# Altium schematic sheet MCU_STM32F103C8T6.SchDoc
size 381 x 241 mm; SheetNumber: 2; SheetTotal: 6
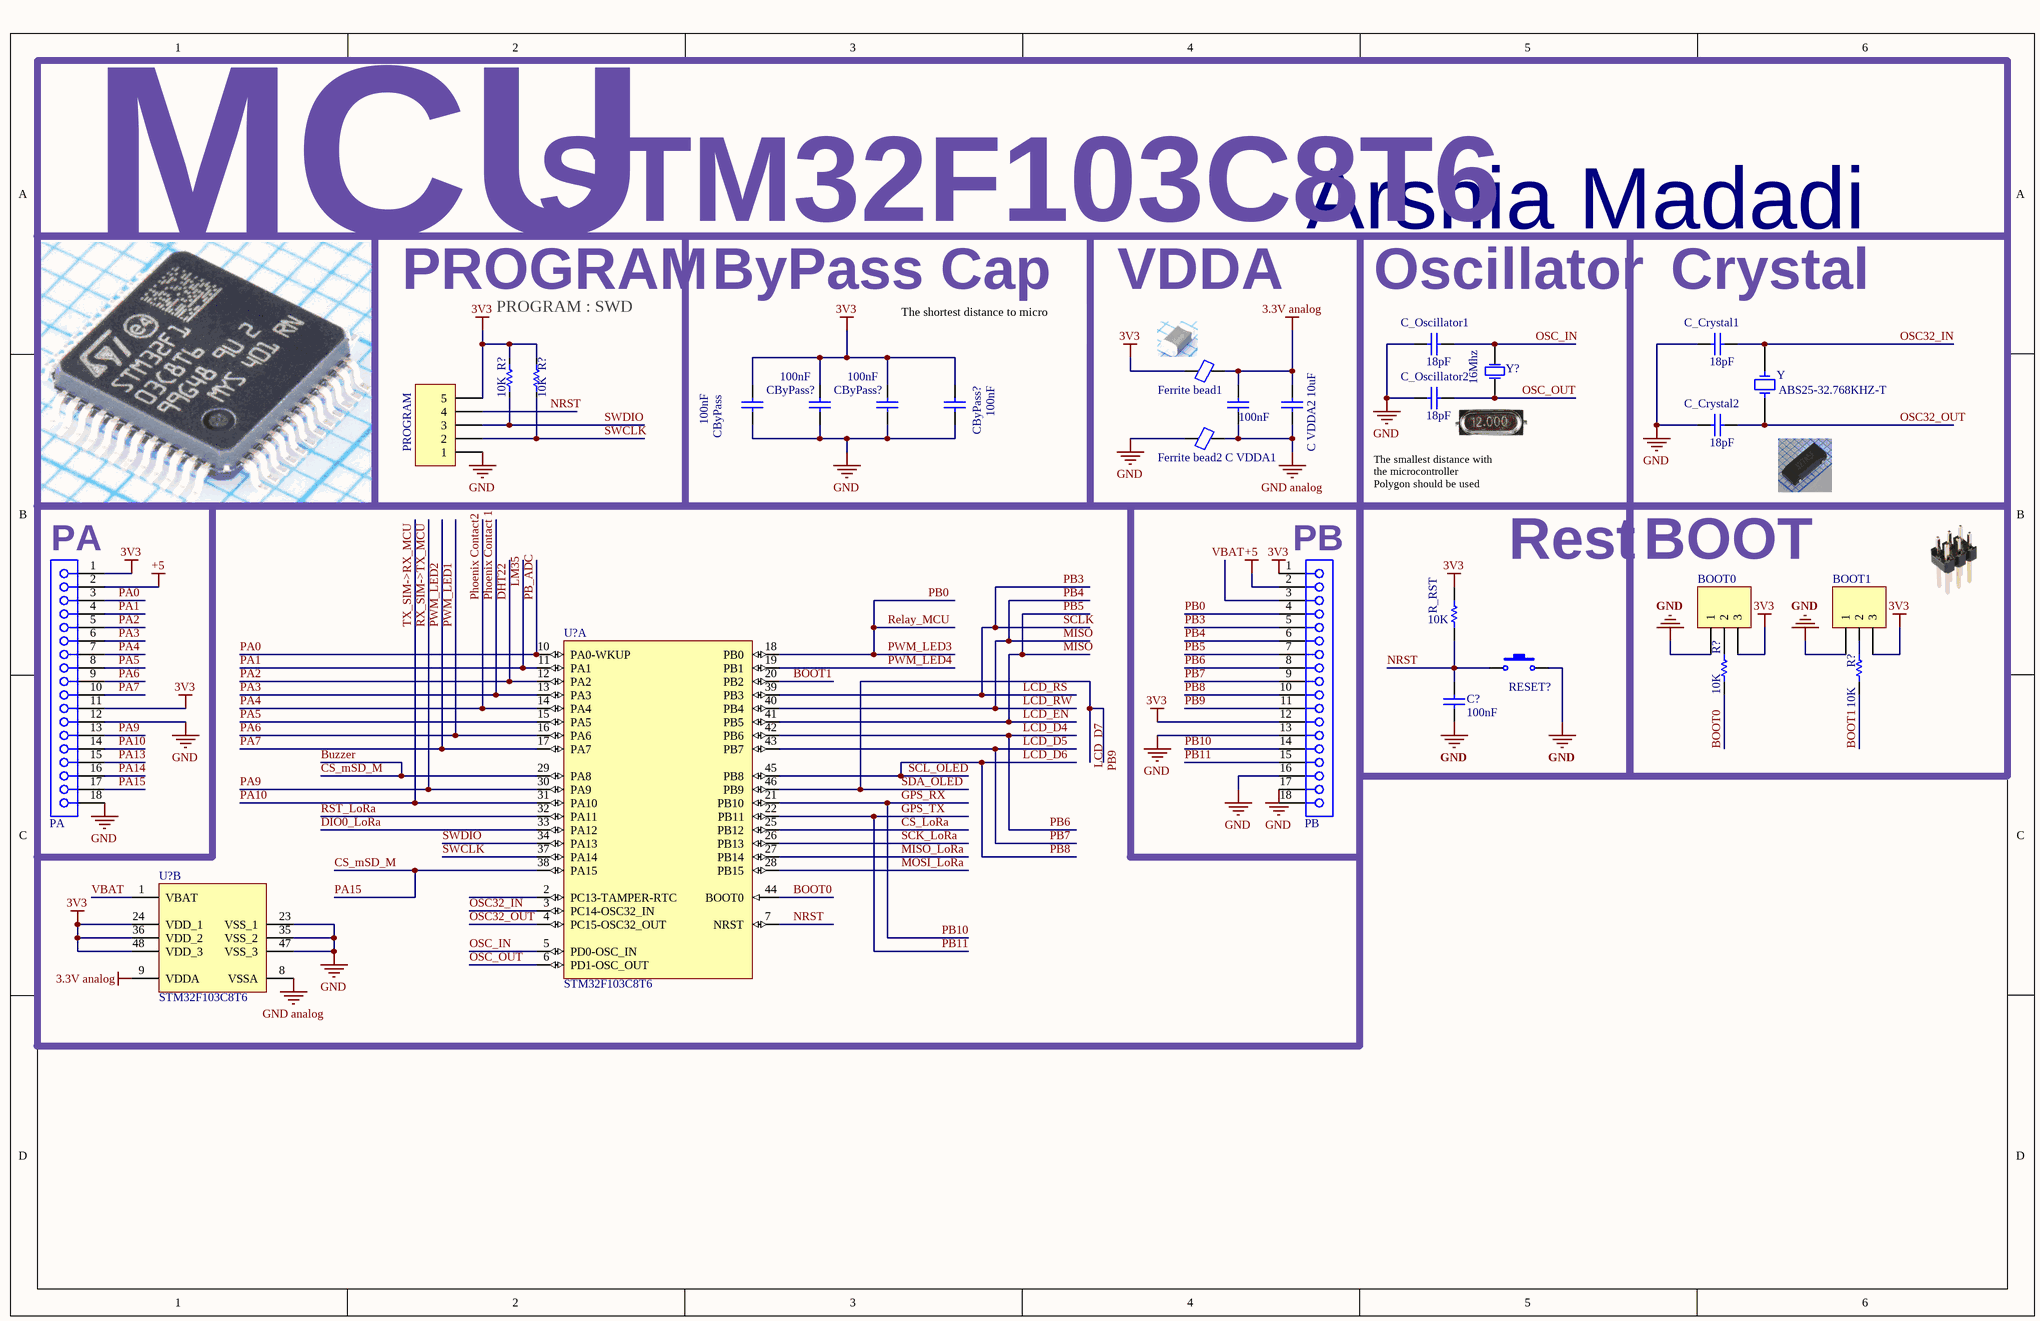
[diagram p0: MCU_STM32F103C8T6.SchDoc]

## Parts
(Parts that share a designator on the sheet are numbered #1, #2 ... from top to bottom, then left to right.)
BOOT0  Header 3  [My_1X03]  (value not drawn)
BOOT1  Header 3  [My_1X03]  (value not drawn)
C?  100nF  [CAPC4817X12N]
C_Crystal1  18pF  [CAPC4817X12N]
C_Crystal2  18pF  [CAPC4817X12N]
C_Oscillator1  18pF  [CAPC4817X12N]
C_Oscillator2  18pF  [CAPC4817X12N]
C_VDDA1  100nF  [CAPC4817X12N]
C_VDDA2  10uF  [CAPC4817X12N]
CByPass  100nF  [CAPC4817X12N]
CByPass?#1  100nF  [CAPC4817X12N]
CByPass?#2  100nF  [CAPC4817X12N]
CByPass?#3  100nF  [CAPC4817X12N]
Ferrite_bead1  Ferrite Bead SMD  [FB1206]  (value not drawn)
Ferrite_bead2  Ferrite Bead SMD  [FB1206]  (value not drawn)
PA  61301811821  [61301811821]  (value not drawn)
PB  61301811821  [61301811821]  (value not drawn)
PROGRAM  Header 5  [My_1X05]  (value not drawn)
R?#1  10K  [1206_Res]
R?#2  10K  [1206_Res]
R?#3  10K  [RESC4817X04N]
R?#4  10K  [RESC4817X04N]
R_RST  10K  [RESC4817X04N]
RESET?  Switch PB  [Switch - Push to On]  (value not drawn)
U?#1  STM32F103C8T6  [STM-LQFP48_M]  (part A of 2)
U?#2  STM32F103C8T6  [STM-LQFP48_M]  (part B of 2)
Y  ABS25-32.768KHZ-T  [XTAL_ABS25-32.768KHZ-6-1-T]
Y?  16Mhz  [Crystal]

## Blocks framed on the sheet
MCU: C_Crystal1 C_Crystal2 C_Oscillator1 C_Oscillator2 C_VDDA1 C_VDDA2 CByPass CByPass?#1-CByPass?#3 Ferrite_bead1 Ferrite_bead2 PROGRAM R?#1 R?#2 Y Y?
PA: PA
PB: PB
Rest: C? R_RST RESET?
BOOT: BOOT0 BOOT1 R?#3 R?#4

## Nets
3.3V analog: C_VDDA1.2 C_VDDA2.2 Ferrite_bead1.2 U?#2.9(VDDA)
3V3: BOOT0.3 BOOT1.3 CByPass.2 CByPass?#1.2 CByPass?#2.2 CByPass?#3.2 Ferrite_bead1.1 PA.1 PA.11 PB.1 PB.12 PROGRAM.5 R?#1.2 R?#2.2 R_RST.2 U?#2.24(VDD_1) U?#2.36(VDD_2) U?#2.48(VDD_3)
+5: PA.2 PB.2
GND: BOOT0.1 BOOT1.1 C?.1 C_Crystal1.1 C_Crystal2.1 C_Oscillator1.1 C_Oscillator2.1 CByPass.1 CByPass?#1.1 CByPass?#2.1 CByPass?#3.1 Ferrite_bead2.1 PA.12 PA.18 PB.13 PB.16 PB.17 PROGRAM.1 RESET?.2 U?#2.23(VSS_1) U?#2.35(VSS_2) U?#2.47(VSS_3)
GND analog: C_VDDA1.1 C_VDDA2.1 Ferrite_bead2.2 U?#2.8(VSSA)
BOOT0: R?#3.1 U?#1.44(BOOT0)
BOOT1: R?#4.1 U?#1.20(PB2)
Buzzer: PA.17 U?#1.29(PA8) U?#1.38(PA15)  [also labelled CS_mSD_M, PA15]
CS_LoRa: U?#1.25(PB12)
DHT22: PA.5 U?#1.12(PA2)  [also labelled PA2]
DIO0_LoRa: U?#1.33(PA12)
GPS_RX: PB.14 U?#1.21(PB10)  [also labelled PB10]
GPS_TX: PB.15 U?#1.22(PB11)  [also labelled PB11]
LCD_D4: PB.8 U?#1.42(PB6)  [also labelled PB6]
LCD_D5: PB.9 U?#1.43(PB7)  [also labelled PB7]
LCD_D6: PB.10 U?#1.45(PB8)  [also labelled PB8, SCL_OLED]
LCD_D7: PB.11 U?#1.46(PB9)  [also labelled PB9, SDA_OLED]
LCD_EN: PB.6 PB.7 U?#1.40(PB4) U?#1.41(PB5)  [also labelled LCD_RW, MISO, PB4, PB5]
LCD_RS: PB.5 U?#1.39(PB3)  [also labelled PB3, SCLK]
LM35: PA.4 U?#1.11(PA1)  [also labelled PA1]
MISO_LoRa: U?#1.27(PB14)
MOSI_LoRa: U?#1.28(PB15)
NRST: C?.2 PROGRAM.4 R_RST.1 RESET?.1 U?#1.7(NRST)
OSC32_IN: C_Crystal1.2 U?#1.3(PC14-OSC32_IN) Y.4
OSC32_OUT: C_Crystal2.2 U?#1.4(PC15-OSC32_OUT) Y.1
OSC_IN: C_Oscillator1.2 U?#1.5(PD0-OSC_IN) Y?.2(OSC2)
OSC_OUT: C_Oscillator2.2 U?#1.6(PD1-OSC_OUT) Y?.1(OSC1)
PA0: PA.3 U?#1.10(PA0-WKUP)  [also labelled PB_ADC]
PA3: PA.6 U?#1.13(PA3)  [also labelled Phoenix Contact 1]
PA4: PA.7 U?#1.14(PA4)  [also labelled Phoenix Contact2]
PA5: PA.8 U?#1.15(PA5)
PA6: PA.9 U?#1.16(PA6)  [also labelled PWM_LED1]
PA7: PA.10 U?#1.17(PA7)  [also labelled PWM_LED2]
PA9: PA.13 U?#1.30(PA9)  [also labelled RX_SIM->TX_MCU]
PA10: PA.14 U?#1.31(PA10)  [also labelled TX_SIM->RX_MCU]
PA13: PA.15
PA14: PA.16
PB0: PB.4 U?#1.18(PB0)  [also labelled PWM_LED3, Relay_MCU]
PWM_LED4: U?#1.19(PB1)
RST_LoRa: U?#1.32(PA11)
SCK_LoRa: U?#1.26(PB13)
SWCLK: PROGRAM.2 R?#2.1 U?#1.37(PA14)
SWDIO: PROGRAM.3 R?#1.1 U?#1.34(PA13)
VBAT: U?#2.1(VBAT)
NetBOOT1_2: BOOT1.2 R?#4.2

Not connected (* = marked no-connect by the designer): BOOT0 2; PB 3 18; R?#3 2; U?#1 2(PC13-TAMPER-RTC)

## Notes on the sheet
- STM32F103C8T6
- Arshia Madadi
- PROGRAM
- (near R?#1) PROGRAM : SWD
- ByPass Cap
- VDDA
- Oscillator
- (near C_Crystal1) Crystal
- The shortest distance to micro
- The smallest distance with the microcontroller
  Polygon should be used
- Labels drawn without touching a wire or pin: VBAT

## Library data of the parts
BOOT0 BOOT1 = Header 3: Header, 3-Pin; LatestRevisionDate: 17-Jul-2002; LatestRevisionNote: Re-released for DXP Platform.; Publisher: Altium Limited
C? C_Crystal1 C_Crystal2 C_Oscillator1 C_Oscillator2 C_VDDA1 C_VDDA2 CByPass CByPass?#1-CByPass?#3 = CAP SMD 1206: CAP 1206; Designer: Abbas Basereh; Desc.: CAP SMD 1206; Data: 16-12-2016
Ferrite_bead1 Ferrite_bead2 = Ferrite Bead SMD Package: Designer: Ali Hafizi
PA PB = 61301811821: WR-PHD Socket Header, THT, Vertical, pitch 2.54mm, 1 Row, 18P; Manufacturer: Wurth Elektronik; Contact Resistance: 20mOhm; Rated Current: 3A; Working Voltage: 250V; Withstanding Voltage: 500V; Manufacturer Part Number: 61301811821; Category: Board-to-Board Connectors; Match Code: WR-PHD; ComponentLink1Description: Website Link; ComponentLink1URL: https://www.we-online.com/redexpert/article/61301811821?ad; ComponentLink2Description: Datasheet Link; ComponentLink2URL: https://www.we-online.com/redexpert/spec/61301811821?ad; Mount: Through Hole; Operating Temperature Max: 105°C; Operating Temperature Min: -40°C; Packaging: Tray; Gender: Socket Header; Number of Pins: 18; Number of Rows: 1; Orientation: Vertical; Pitch: 2.54mm
PROGRAM = Header 5: Header, 5-Pin; LatestRevisionDate: 17-Jul-2002; LatestRevisionNote: Re-released for DXP Platform.; Publisher: Altium Limited
R?#1 R?#2 = Res: Resistor; Published: 8-Jun-2000; LatestRevisionDate: 17-Jul-2002; LatestRevisionNote: Re-released for DXP Platform.; PackageReference: AXIAL-0.3; Publisher: Altium Limited
R?#3 R?#4 R_RST = RES 1206 0.25W: RES 1206; Designer: Abbas Basereh; Desc.: RES SMD 1206; Data: 16-12-2016
RESET? = Switch PB: Push Button Switch
U?#1 U?#2 = STM32F103C8T6: ARM Cortex-M3 32-bit MCU, 64 KB Flash, 20 KB Internal RAM, 37 I/Os, 48-pin LQFP, -40 to 85 degC, Tray; A/D Converter: 2x12-bit (10 Channel); FLASH Size (Prog) (kB): 64; I/Os (High Current): 37; Internal RAM Size (kB): 20; Operating Frequency(F) (Processor speed) (MHz): 72; Supply Voltage(Vcc) min (V): 2; DatasheetVersion: Rev. 16; PackageVersion: Rev. 6, 06/2013; PackageReference: LQFP48; PackageDescription: 48-Pin Low Profile Quad Flat Package, 7 x 7 mm Body, 0.5 mm Pitch; Supplier 1: Digi-Key; Supplier Part Number 1: 497-6063-ND; Supplier 2: Farnell; Supplier Part Number 2: 1447637; Supplier 3: Newark; Supplier Part Number 3: 59M2182; Supplier 4: Newark; Supplier Part Number 4: 57P1222; Supplier 5: Mouser; Supplier Part Number 5: 511-STM32F103C8T6; Core: ARM Cortex-M3; Packing: Tray; Mounting Technology: Surface Mount; PartNumber: STM32F103C8T6; ComponentLink1Description: Manufacturer URL; ComponentLink1URL: http://www.st.com/web/en/home.html; ComponentLink2Description: Datasheet; ComponentLink2URL: http://www.st.com/st-web-ui/static/active/en/resource/technical/document/datasheet/CD00161566.pdf; ComponentLink3Description: Package Specification; ComponentLink3URL: http://www.st.com/st-web-ui/static/active/en/resource/technical/document/datasheet/DM00058181.pdf
Y = ABS25-32.768KHZ-T: 32.768kHz Â±20ppm Crystal 12.5pF 50 kOhms 4-SOJ, 5.50mm pitch; MF: Abracon LLC; Package: 4-4 Abracon LLC; MP: ABS25-32.768KHZ; Value: *; Availability: Unavailable; Price: None; SnapEDA_Link: https://www.snapeda.com/parts/ABS25-32.768KHZ/Abracon%20LLC/view-part/478888/?ref=snap
Y? = XTAL: Crystal Oscillator; Published: 8-Jun-2000; LatestRevisionDate: 17-Jul-2002; LatestRevisionNote: Re-released for DXP Platform.; PackageReference: R38; Publisher: Altium Limited